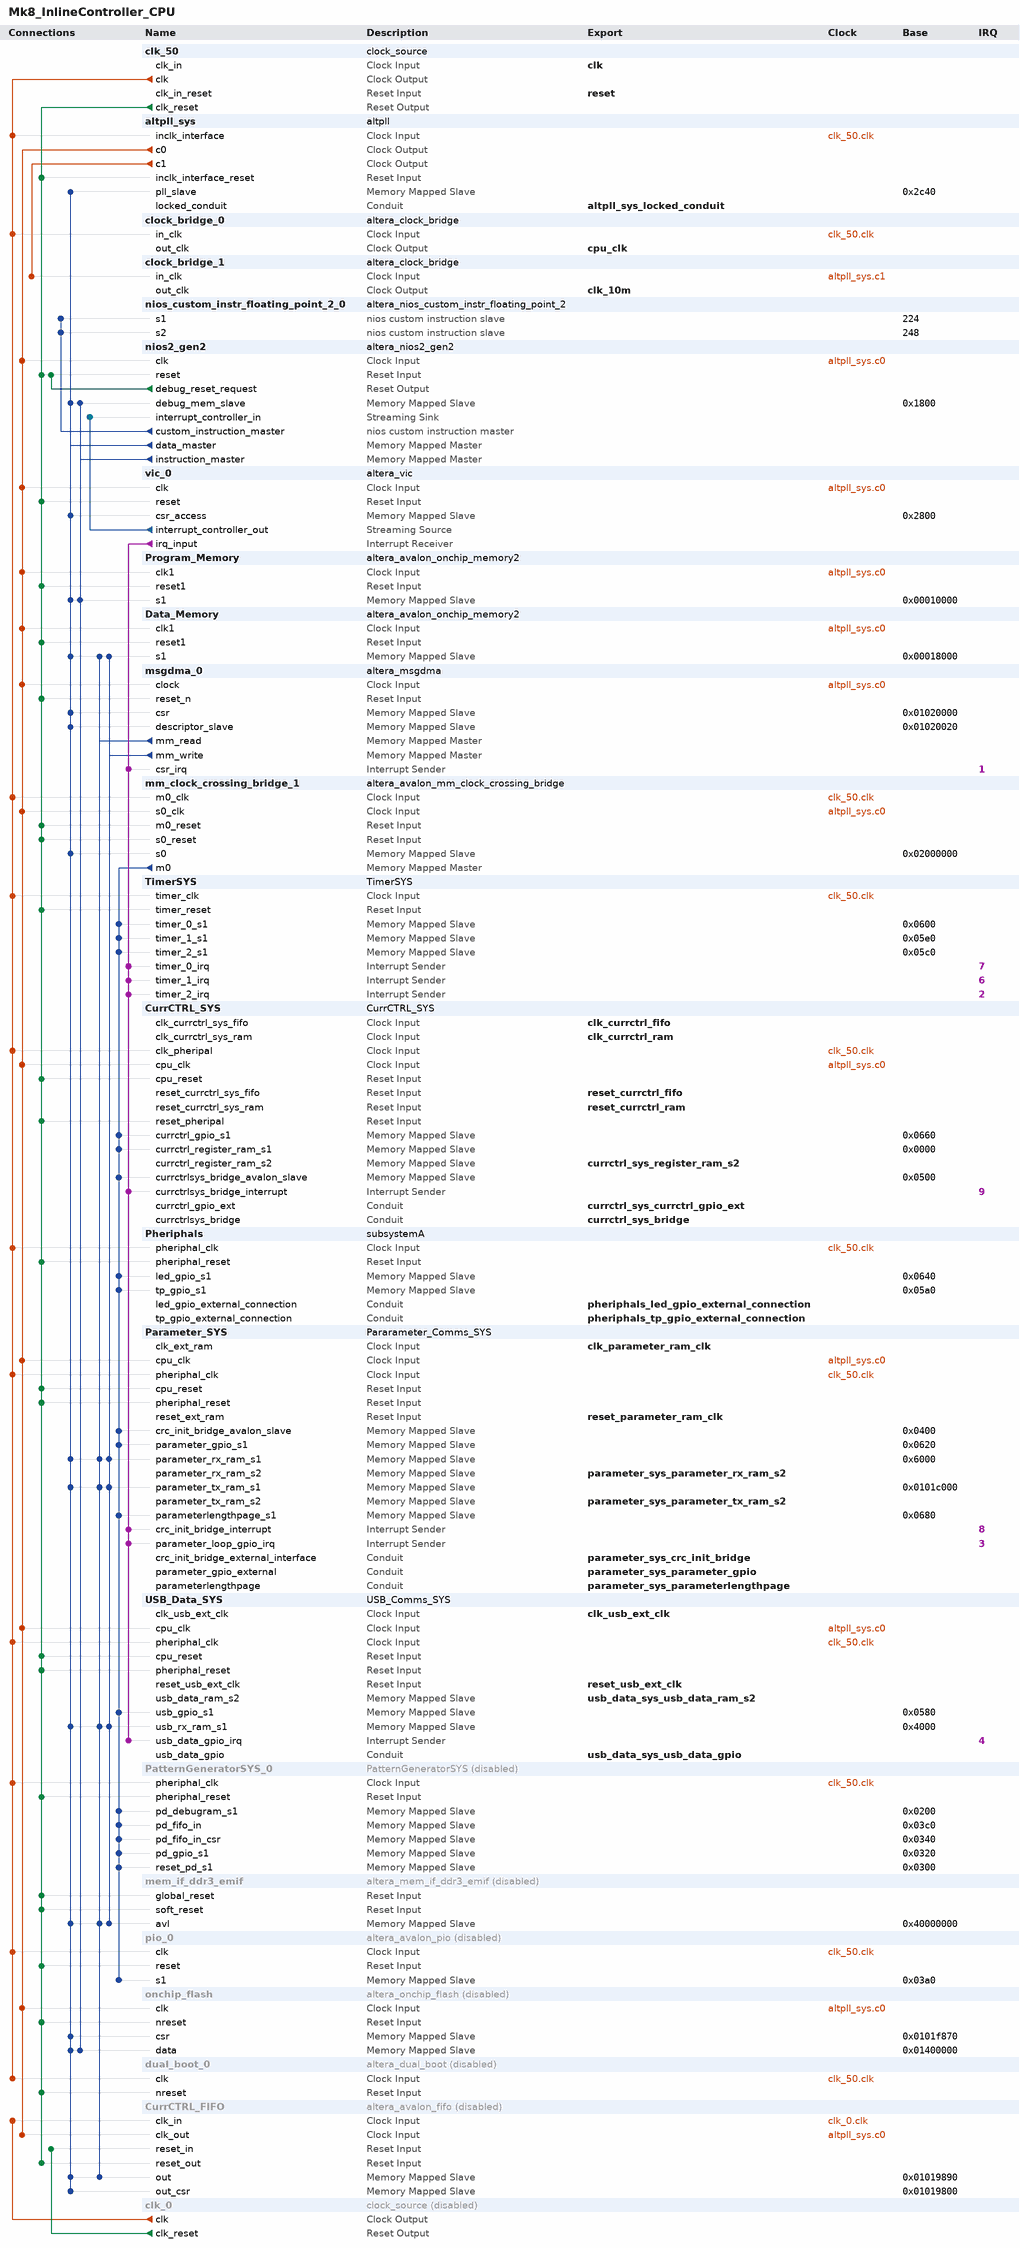
[diagram p0: system contents]
# Platform Designer (Qsys) system Mk8_InlineController_CPU, MAX 10 10M50DAF484I7G
# Parameters at their usual value, and those the tool derives, are not listed.
package require -exact qsys 18.1
create_system Mk8_InlineController_CPU
set_project_property DEVICE_FAMILY {MAX 10}
set_project_property DEVICE 10M50DAF484I7G

add_instance clk_50 clock_source 18.1
set_instance_parameter_value clk_50 clockFrequency 50000000

add_instance altpll_sys altpll 18.1
set_instance_parameter_value altpll_sys CLK0_DIVIDE_BY 2
set_instance_parameter_value altpll_sys CLK0_MULTIPLY_BY 3
set_instance_parameter_value altpll_sys CLK1_DIVIDE_BY 5
set_instance_parameter_value altpll_sys CLK1_DUTY_CYCLE 50
set_instance_parameter_value altpll_sys CLK1_MULTIPLY_BY 1
set_instance_parameter_value altpll_sys CLK1_PHASE_SHIFT 0
set_instance_parameter_value altpll_sys CLK2_DIVIDE_BY 1
set_instance_parameter_value altpll_sys CLK2_DUTY_CYCLE 50
set_instance_parameter_value altpll_sys CLK2_MULTIPLY_BY 4
set_instance_parameter_value altpll_sys CLK2_PHASE_SHIFT 0
set_instance_parameter_value altpll_sys CLK3_DIVIDE_BY 5
set_instance_parameter_value altpll_sys CLK3_DUTY_CYCLE 50
set_instance_parameter_value altpll_sys CLK3_MULTIPLY_BY 1
set_instance_parameter_value altpll_sys CLK3_PHASE_SHIFT 0
set_instance_parameter_value altpll_sys CLK4_DIVIDE_BY 1
set_instance_parameter_value altpll_sys CLK4_DUTY_CYCLE 50
set_instance_parameter_value altpll_sys CLK4_MULTIPLY_BY 4
set_instance_parameter_value altpll_sys CLK4_PHASE_SHIFT 0
set_instance_parameter_value altpll_sys INCLK0_INPUT_FREQUENCY 20000
set_instance_parameter_value altpll_sys PORT_ARESET PORT_UNUSED
set_instance_parameter_value altpll_sys PORT_LOCKED PORT_USED
set_instance_parameter_value altpll_sys PORT_clk1 PORT_USED
set_instance_parameter_value altpll_sys PORT_clk2 PORT_UNUSED
set_instance_parameter_value altpll_sys PORT_clk3 PORT_UNUSED

add_instance clock_bridge_0 altera_clock_bridge 18.1
set_instance_parameter_value clock_bridge_0 DERIVED_CLOCK_RATE 50000000
set_instance_parameter_value clock_bridge_0 EXPLICIT_CLOCK_RATE 0

add_instance clock_bridge_1 altera_clock_bridge 18.1
set_instance_parameter_value clock_bridge_1 DERIVED_CLOCK_RATE 10000000
set_instance_parameter_value clock_bridge_1 EXPLICIT_CLOCK_RATE 0

add_instance nios_custom_instr_floating_point_2_0 altera_nios_custom_instr_floating_point_2 18.1
set_instance_parameter_value nios_custom_instr_floating_point_2_0 arithmetic_present true
set_instance_parameter_value nios_custom_instr_floating_point_2_0 comparison_present true
set_instance_parameter_value nios_custom_instr_floating_point_2_0 conversion_present true
set_instance_parameter_value nios_custom_instr_floating_point_2_0 root_present false

add_instance nios2_gen2 altera_nios2_gen2 18.1
set_instance_parameter_value nios2_gen2 dcache_size 0
set_instance_parameter_value nios2_gen2 exceptionSlave Program_Memory.s1
set_instance_parameter_value nios2_gen2 icache_size 4096
set_instance_parameter_value nios2_gen2 impl Fast
set_instance_parameter_value nios2_gen2 io_regionbase 262144
set_instance_parameter_value nios2_gen2 mul_64_impl 1
set_instance_parameter_value nios2_gen2 mul_shift_choice 1
set_instance_parameter_value nios2_gen2 resetSlave Program_Memory.s1
set_instance_parameter_value nios2_gen2 setting_interruptControllerType External
set_instance_parameter_value nios2_gen2 setting_shadowRegisterSets 8

add_instance vic_0 altera_vic 18.1
set_instance_parameter_value vic_0 DAISY_CHAIN_ENABLE 0
set_instance_parameter_value vic_0 INTERRUPT_LATENCY_CYCLES 2
set_instance_parameter_value vic_0 NUMBER_OF_INT_PORTS 10
set_instance_parameter_value vic_0 OVERRIDE_INTERRUPT_LATENCY false
set_instance_parameter_value vic_0 RIL_WIDTH 4

add_instance Program_Memory altera_avalon_onchip_memory2 18.1
set_instance_parameter_value Program_Memory dataWidth 32
set_instance_parameter_value Program_Memory dualPort false
set_instance_parameter_value Program_Memory initMemContent true
set_instance_parameter_value Program_Memory initializationFileName C:/DesignData/CoilDriverDesigns/Mk_8/Inline_Controller/HardwareDesignCopy/EB_Mk8_Inline_Controller_Hardware/software/Temp_inlineCode/mem_init/Mk8_InlineController_CPU_Program_Memory.hex
set_instance_parameter_value Program_Memory memorySize 32768

add_instance Data_Memory altera_avalon_onchip_memory2 18.1
set_instance_parameter_value Data_Memory dataWidth 32
set_instance_parameter_value Data_Memory dualPort false
set_instance_parameter_value Data_Memory initMemContent true
set_instance_parameter_value Data_Memory initializationFileName onchip_mem.hex
set_instance_parameter_value Data_Memory memorySize 9216

add_instance msgdma_0 altera_msgdma 18.1
set_instance_parameter_value msgdma_0 BURST_ENABLE 0
set_instance_parameter_value msgdma_0 DATA_FIFO_DEPTH 32
set_instance_parameter_value msgdma_0 DATA_WIDTH 32
set_instance_parameter_value msgdma_0 DESCRIPTOR_FIFO_DEPTH 128
set_instance_parameter_value msgdma_0 ENHANCED_FEATURES 1
set_instance_parameter_value msgdma_0 ERROR_ENABLE 0
set_instance_parameter_value msgdma_0 MAX_BURST_COUNT 2
set_instance_parameter_value msgdma_0 MAX_BYTE 8192
set_instance_parameter_value msgdma_0 MODE 0
set_instance_parameter_value msgdma_0 PACKET_ENABLE 0
set_instance_parameter_value msgdma_0 STRIDE_ENABLE 1
set_instance_parameter_value msgdma_0 TRANSFER_TYPE {Full Word Accesses Only}

add_instance mm_clock_crossing_bridge_1 altera_avalon_mm_clock_crossing_bridge 18.1
set_instance_parameter_value mm_clock_crossing_bridge_1 ADDRESS_WIDTH 10
set_instance_parameter_value mm_clock_crossing_bridge_1 COMMAND_FIFO_DEPTH 4
set_instance_parameter_value mm_clock_crossing_bridge_1 DATA_WIDTH 32
set_instance_parameter_value mm_clock_crossing_bridge_1 MASTER_SYNC_DEPTH 2
set_instance_parameter_value mm_clock_crossing_bridge_1 MAX_BURST_SIZE 1
set_instance_parameter_value mm_clock_crossing_bridge_1 RESPONSE_FIFO_DEPTH 4
set_instance_parameter_value mm_clock_crossing_bridge_1 SLAVE_SYNC_DEPTH 2
set_instance_parameter_value mm_clock_crossing_bridge_1 USE_AUTO_ADDRESS_WIDTH 1

add_instance TimerSYS TimerSYS 1.0

add_instance CurrCTRL_SYS CurrCTRL_SYS 1.0

add_instance Pheriphals subsystemA 1.0

add_instance Parameter_SYS Pararameter_Comms_SYS 1.0

add_instance USB_Data_SYS USB_Comms_SYS 1.0

add_instance PatternGeneratorSYS_0 PatternGeneratorSYS 1.0
set_instance_property PatternGeneratorSYS_0 ENABLED false

add_instance mem_if_ddr3_emif altera_mem_if_ddr3_emif 18.1
set_instance_property mem_if_ddr3_emif ENABLED false
set_instance_parameter_value mem_if_ddr3_emif AVL_MAX_SIZE 4
set_instance_parameter_value mem_if_ddr3_emif CALIBRATION_MODE Skip
set_instance_parameter_value mem_if_ddr3_emif CPORT_TYPE_PORT Bidirectional,Bidirectional,Bidirectional,Bidirectional,Bidirectional,Bidirectional
set_instance_parameter_value mem_if_ddr3_emif EXPORT_AFI_HALF_CLK false
set_instance_parameter_value mem_if_ddr3_emif HARD_EMIF false
set_instance_parameter_value mem_if_ddr3_emif MEM_BANKADDR_WIDTH 3
set_instance_parameter_value mem_if_ddr3_emif MEM_CLK_FREQ 300.0
set_instance_parameter_value mem_if_ddr3_emif MEM_CLK_FREQ_MAX 800.0
set_instance_parameter_value mem_if_ddr3_emif MEM_COL_ADDR_WIDTH 10
set_instance_parameter_value mem_if_ddr3_emif MEM_DQ_WIDTH 16
set_instance_parameter_value mem_if_ddr3_emif MEM_FORMAT DISCRETE
set_instance_parameter_value mem_if_ddr3_emif MEM_ROW_ADDR_WIDTH 16
set_instance_parameter_value mem_if_ddr3_emif MEM_TCL 7
set_instance_parameter_value mem_if_ddr3_emif MEM_TFAW_NS 45.0
set_instance_parameter_value mem_if_ddr3_emif MEM_TRAS_NS 35.0
set_instance_parameter_value mem_if_ddr3_emif MEM_TRCD_NS 13.75
set_instance_parameter_value mem_if_ddr3_emif MEM_TRFC_NS 260.0
set_instance_parameter_value mem_if_ddr3_emif MEM_TRP_NS 13.75
set_instance_parameter_value mem_if_ddr3_emif MEM_TRRD_NS 7.5
set_instance_parameter_value mem_if_ddr3_emif MEM_TRTP_NS 7.5
set_instance_parameter_value mem_if_ddr3_emif MEM_TWTR 6
set_instance_parameter_value mem_if_ddr3_emif MEM_VENDOR Micron
set_instance_parameter_value mem_if_ddr3_emif MEM_WTCL 6
set_instance_parameter_value mem_if_ddr3_emif PLL_LOCATION Top_Bottom
set_instance_parameter_value mem_if_ddr3_emif POWER_OF_TWO_BUS true
set_instance_parameter_value mem_if_ddr3_emif PRIORITY_PORT 1,1,1,1,1,1
set_instance_parameter_value mem_if_ddr3_emif RATE Half
set_instance_parameter_value mem_if_ddr3_emif REF_CLK_FREQ 60.0
set_instance_parameter_value mem_if_ddr3_emif SPEED_GRADE 6
set_instance_parameter_value mem_if_ddr3_emif TIMING_BOARD_AC_SKEW 0.017
set_instance_parameter_value mem_if_ddr3_emif TIMING_BOARD_AC_TO_CK_SKEW -1.3E-4
set_instance_parameter_value mem_if_ddr3_emif TIMING_BOARD_DQ_TO_DQS_SKEW -6.0E-4
set_instance_parameter_value mem_if_ddr3_emif TIMING_BOARD_MAX_CK_DELAY 0.183
set_instance_parameter_value mem_if_ddr3_emif TIMING_BOARD_MAX_DQS_DELAY 0.181
set_instance_parameter_value mem_if_ddr3_emif TIMING_BOARD_SKEW_BETWEEN_DQS 0.005
set_instance_parameter_value mem_if_ddr3_emif TIMING_BOARD_SKEW_CKDQS_DIMM_MAX 0.007
set_instance_parameter_value mem_if_ddr3_emif TIMING_BOARD_SKEW_CKDQS_DIMM_MIN 0.002
set_instance_parameter_value mem_if_ddr3_emif TIMING_BOARD_SKEW_WITHIN_DQS 0.008
set_instance_parameter_value mem_if_ddr3_emif TIMING_TDH 55
set_instance_parameter_value mem_if_ddr3_emif TIMING_TDQSCK 225
set_instance_parameter_value mem_if_ddr3_emif TIMING_TDQSQ 125
set_instance_parameter_value mem_if_ddr3_emif TIMING_TDQSS 0.25
set_instance_parameter_value mem_if_ddr3_emif TIMING_TDS 55
set_instance_parameter_value mem_if_ddr3_emif TIMING_TDSH 0.2
set_instance_parameter_value mem_if_ddr3_emif TIMING_TDSS 0.2
set_instance_parameter_value mem_if_ddr3_emif TIMING_TIH 130
set_instance_parameter_value mem_if_ddr3_emif TIMING_TIS 185
set_instance_parameter_value mem_if_ddr3_emif TIMING_TQSH 0.4
set_instance_parameter_value mem_if_ddr3_emif USER_DEBUG_LEVEL 1

add_instance pio_0 altera_avalon_pio 18.1
set_instance_property pio_0 ENABLED false
set_instance_parameter_value pio_0 direction Input
set_instance_parameter_value pio_0 simDoTestBenchWiring true
set_instance_parameter_value pio_0 width 4

add_instance onchip_flash altera_onchip_flash 18.1
set_instance_property onchip_flash ENABLED false
set_instance_parameter_value onchip_flash CLOCK_FREQUENCY 100.0
set_instance_parameter_value onchip_flash CONFIGURATION_MODE {Single Compressed Image with Memory Initialization}
set_instance_parameter_value onchip_flash SECTOR_ACCESS_MODE {Read and write,Read and write,Read and write,Read and write,Read and write}
set_instance_parameter_value onchip_flash initFlashContent false
set_instance_parameter_value onchip_flash initializationFileName altera_onchip_flash.hex
set_instance_parameter_value onchip_flash useNonDefaultInitFile false

add_instance dual_boot_0 altera_dual_boot 18.1
set_instance_property dual_boot_0 ENABLED false
set_instance_parameter_value dual_boot_0 CLOCK_FREQUENCY 50.0

add_instance CurrCTRL_FIFO altera_avalon_fifo 18.1
set_instance_property CurrCTRL_FIFO ENABLED false
set_instance_parameter_value CurrCTRL_FIFO bitsPerSymbol 16
set_instance_parameter_value CurrCTRL_FIFO channelWidth 8
set_instance_parameter_value CurrCTRL_FIFO errorWidth 8
set_instance_parameter_value CurrCTRL_FIFO fifoDepth 8192
set_instance_parameter_value CurrCTRL_FIFO fifoInputInterfaceOptions AVALONMM_WRITE
set_instance_parameter_value CurrCTRL_FIFO fifoOutputInterfaceOptions AVALONMM_READ
set_instance_parameter_value CurrCTRL_FIFO singleClockMode false
set_instance_parameter_value CurrCTRL_FIFO symbolsPerBeat 2
set_instance_parameter_value CurrCTRL_FIFO useBackpressure false
set_instance_parameter_value CurrCTRL_FIFO useIRQ false
set_instance_parameter_value CurrCTRL_FIFO usePacket true
set_instance_parameter_value CurrCTRL_FIFO useReadControl true
set_instance_parameter_value CurrCTRL_FIFO useWriteControl false

add_instance clk_0 clock_source 18.1
set_instance_property clk_0 ENABLED false
set_instance_parameter_value clk_0 clockFrequency 50000000

# connections
add_connection altpll_sys.c0 CurrCTRL_FIFO.clk_out clock
add_connection altpll_sys.c0 CurrCTRL_SYS.cpu_clk clock
add_connection altpll_sys.c0 Data_Memory.clk1 clock
add_connection altpll_sys.c0 mm_clock_crossing_bridge_1.s0_clk clock
add_connection altpll_sys.c0 msgdma_0.clock clock
add_connection altpll_sys.c0 nios2_gen2.clk clock
add_connection altpll_sys.c0 onchip_flash.clk clock
add_connection altpll_sys.c0 Parameter_SYS.cpu_clk clock
add_connection altpll_sys.c0 Program_Memory.clk1 clock
add_connection altpll_sys.c0 USB_Data_SYS.cpu_clk clock
add_connection altpll_sys.c0 vic_0.clk clock
add_connection altpll_sys.c1 clock_bridge_1.in_clk clock
add_connection clk_0.clk CurrCTRL_FIFO.clk_in clock
add_connection clk_50.clk altpll_sys.inclk_interface clock
add_connection clk_50.clk clock_bridge_0.in_clk clock
add_connection clk_50.clk CurrCTRL_SYS.clk_pheripal clock
add_connection clk_50.clk dual_boot_0.clk clock
add_connection clk_50.clk mm_clock_crossing_bridge_1.m0_clk clock
add_connection clk_50.clk Parameter_SYS.pheriphal_clk clock
add_connection clk_50.clk PatternGeneratorSYS_0.pheriphal_clk clock
add_connection clk_50.clk Pheriphals.pheriphal_clk clock
add_connection clk_50.clk pio_0.clk clock
add_connection clk_50.clk TimerSYS.timer_clk clock
add_connection clk_50.clk USB_Data_SYS.pheriphal_clk clock
add_connection clk_0.clk_reset CurrCTRL_FIFO.reset_in reset
add_connection clk_50.clk_reset altpll_sys.inclk_interface_reset reset
add_connection clk_50.clk_reset CurrCTRL_FIFO.reset_out reset
add_connection clk_50.clk_reset CurrCTRL_SYS.cpu_reset reset
add_connection clk_50.clk_reset CurrCTRL_SYS.reset_pheripal reset
add_connection clk_50.clk_reset Data_Memory.reset1 reset
add_connection clk_50.clk_reset dual_boot_0.nreset reset
add_connection clk_50.clk_reset mem_if_ddr3_emif.global_reset reset
add_connection clk_50.clk_reset mem_if_ddr3_emif.soft_reset reset
add_connection clk_50.clk_reset mm_clock_crossing_bridge_1.m0_reset reset
add_connection clk_50.clk_reset mm_clock_crossing_bridge_1.s0_reset reset
add_connection clk_50.clk_reset msgdma_0.reset_n reset
add_connection clk_50.clk_reset nios2_gen2.reset reset
add_connection clk_50.clk_reset onchip_flash.nreset reset
add_connection clk_50.clk_reset Parameter_SYS.cpu_reset reset
add_connection clk_50.clk_reset Parameter_SYS.pheriphal_reset reset
add_connection clk_50.clk_reset PatternGeneratorSYS_0.pheriphal_reset reset
add_connection clk_50.clk_reset Pheriphals.pheriphal_reset reset
add_connection clk_50.clk_reset pio_0.reset reset
add_connection clk_50.clk_reset Program_Memory.reset1 reset
add_connection clk_50.clk_reset TimerSYS.timer_reset reset
add_connection clk_50.clk_reset USB_Data_SYS.cpu_reset reset
add_connection clk_50.clk_reset USB_Data_SYS.pheriphal_reset reset
add_connection clk_50.clk_reset vic_0.reset reset
add_connection nios2_gen2.debug_reset_request nios2_gen2.reset reset
add_connection mm_clock_crossing_bridge_1.m0 CurrCTRL_SYS.currctrl_gpio_s1 avalon
set_connection_parameter_value mm_clock_crossing_bridge_1.m0/CurrCTRL_SYS.currctrl_gpio_s1 baseAddress 0x0660
add_connection mm_clock_crossing_bridge_1.m0 CurrCTRL_SYS.currctrl_register_ram_s1 avalon
set_connection_parameter_value mm_clock_crossing_bridge_1.m0/CurrCTRL_SYS.currctrl_register_ram_s1 baseAddress 0x0000
add_connection mm_clock_crossing_bridge_1.m0 CurrCTRL_SYS.currctrlsys_bridge_avalon_slave avalon
set_connection_parameter_value mm_clock_crossing_bridge_1.m0/CurrCTRL_SYS.currctrlsys_bridge_avalon_slave baseAddress 0x0500
add_connection mm_clock_crossing_bridge_1.m0 Parameter_SYS.crc_init_bridge_avalon_slave avalon
set_connection_parameter_value mm_clock_crossing_bridge_1.m0/Parameter_SYS.crc_init_bridge_avalon_slave baseAddress 0x0400
add_connection mm_clock_crossing_bridge_1.m0 Parameter_SYS.parameter_gpio_s1 avalon
set_connection_parameter_value mm_clock_crossing_bridge_1.m0/Parameter_SYS.parameter_gpio_s1 baseAddress 0x0620
add_connection mm_clock_crossing_bridge_1.m0 Parameter_SYS.parameterlengthpage_s1 avalon
set_connection_parameter_value mm_clock_crossing_bridge_1.m0/Parameter_SYS.parameterlengthpage_s1 baseAddress 0x0680
add_connection mm_clock_crossing_bridge_1.m0 PatternGeneratorSYS_0.pd_debugram_s1 avalon
set_connection_parameter_value mm_clock_crossing_bridge_1.m0/PatternGeneratorSYS_0.pd_debugram_s1 baseAddress 0x0200
add_connection mm_clock_crossing_bridge_1.m0 PatternGeneratorSYS_0.pd_fifo_in avalon
set_connection_parameter_value mm_clock_crossing_bridge_1.m0/PatternGeneratorSYS_0.pd_fifo_in baseAddress 0x03c0
add_connection mm_clock_crossing_bridge_1.m0 PatternGeneratorSYS_0.pd_fifo_in_csr avalon
set_connection_parameter_value mm_clock_crossing_bridge_1.m0/PatternGeneratorSYS_0.pd_fifo_in_csr baseAddress 0x0340
add_connection mm_clock_crossing_bridge_1.m0 PatternGeneratorSYS_0.pd_gpio_s1 avalon
set_connection_parameter_value mm_clock_crossing_bridge_1.m0/PatternGeneratorSYS_0.pd_gpio_s1 baseAddress 0x0320
add_connection mm_clock_crossing_bridge_1.m0 PatternGeneratorSYS_0.reset_pd_s1 avalon
set_connection_parameter_value mm_clock_crossing_bridge_1.m0/PatternGeneratorSYS_0.reset_pd_s1 baseAddress 0x0300
add_connection mm_clock_crossing_bridge_1.m0 Pheriphals.led_gpio_s1 avalon
set_connection_parameter_value mm_clock_crossing_bridge_1.m0/Pheriphals.led_gpio_s1 baseAddress 0x0640
add_connection mm_clock_crossing_bridge_1.m0 Pheriphals.tp_gpio_s1 avalon
set_connection_parameter_value mm_clock_crossing_bridge_1.m0/Pheriphals.tp_gpio_s1 baseAddress 0x05a0
add_connection mm_clock_crossing_bridge_1.m0 pio_0.s1 avalon
set_connection_parameter_value mm_clock_crossing_bridge_1.m0/pio_0.s1 baseAddress 0x03a0
add_connection mm_clock_crossing_bridge_1.m0 TimerSYS.timer_0_s1 avalon
set_connection_parameter_value mm_clock_crossing_bridge_1.m0/TimerSYS.timer_0_s1 baseAddress 0x0600
add_connection mm_clock_crossing_bridge_1.m0 TimerSYS.timer_1_s1 avalon
set_connection_parameter_value mm_clock_crossing_bridge_1.m0/TimerSYS.timer_1_s1 baseAddress 0x05e0
add_connection mm_clock_crossing_bridge_1.m0 TimerSYS.timer_2_s1 avalon
set_connection_parameter_value mm_clock_crossing_bridge_1.m0/TimerSYS.timer_2_s1 baseAddress 0x05c0
add_connection mm_clock_crossing_bridge_1.m0 USB_Data_SYS.usb_gpio_s1 avalon
set_connection_parameter_value mm_clock_crossing_bridge_1.m0/USB_Data_SYS.usb_gpio_s1 baseAddress 0x0580
add_connection msgdma_0.mm_read CurrCTRL_FIFO.out avalon
set_connection_parameter_value msgdma_0.mm_read/CurrCTRL_FIFO.out baseAddress 0x01019890
add_connection msgdma_0.mm_read Data_Memory.s1 avalon
set_connection_parameter_value msgdma_0.mm_read/Data_Memory.s1 baseAddress 0x00018000
add_connection msgdma_0.mm_read mem_if_ddr3_emif.avl avalon
set_connection_parameter_value msgdma_0.mm_read/mem_if_ddr3_emif.avl baseAddress 0x40000000
add_connection msgdma_0.mm_read Parameter_SYS.parameter_rx_ram_s1 avalon
set_connection_parameter_value msgdma_0.mm_read/Parameter_SYS.parameter_rx_ram_s1 baseAddress 0x6000
add_connection msgdma_0.mm_read Parameter_SYS.parameter_tx_ram_s1 avalon
set_connection_parameter_value msgdma_0.mm_read/Parameter_SYS.parameter_tx_ram_s1 baseAddress 0x0101c000
add_connection msgdma_0.mm_read USB_Data_SYS.usb_rx_ram_s1 avalon
set_connection_parameter_value msgdma_0.mm_read/USB_Data_SYS.usb_rx_ram_s1 baseAddress 0x4000
add_connection msgdma_0.mm_write Data_Memory.s1 avalon
set_connection_parameter_value msgdma_0.mm_write/Data_Memory.s1 baseAddress 0x00018000
add_connection msgdma_0.mm_write mem_if_ddr3_emif.avl avalon
set_connection_parameter_value msgdma_0.mm_write/mem_if_ddr3_emif.avl baseAddress 0x40000000
add_connection msgdma_0.mm_write Parameter_SYS.parameter_rx_ram_s1 avalon
set_connection_parameter_value msgdma_0.mm_write/Parameter_SYS.parameter_rx_ram_s1 baseAddress 0x6000
add_connection msgdma_0.mm_write Parameter_SYS.parameter_tx_ram_s1 avalon
set_connection_parameter_value msgdma_0.mm_write/Parameter_SYS.parameter_tx_ram_s1 baseAddress 0x0101c000
add_connection msgdma_0.mm_write USB_Data_SYS.usb_rx_ram_s1 avalon
set_connection_parameter_value msgdma_0.mm_write/USB_Data_SYS.usb_rx_ram_s1 baseAddress 0x4000
add_connection nios2_gen2.data_master altpll_sys.pll_slave avalon
set_connection_parameter_value nios2_gen2.data_master/altpll_sys.pll_slave baseAddress 0x2c40
add_connection nios2_gen2.data_master CurrCTRL_FIFO.out avalon
set_connection_parameter_value nios2_gen2.data_master/CurrCTRL_FIFO.out baseAddress 0x01019890
add_connection nios2_gen2.data_master CurrCTRL_FIFO.out_csr avalon
set_connection_parameter_value nios2_gen2.data_master/CurrCTRL_FIFO.out_csr baseAddress 0x01019800
add_connection nios2_gen2.data_master Data_Memory.s1 avalon
set_connection_parameter_value nios2_gen2.data_master/Data_Memory.s1 baseAddress 0x00018000
add_connection nios2_gen2.data_master mem_if_ddr3_emif.avl avalon
set_connection_parameter_value nios2_gen2.data_master/mem_if_ddr3_emif.avl baseAddress 0x40000000
add_connection nios2_gen2.data_master mm_clock_crossing_bridge_1.s0 avalon
set_connection_parameter_value nios2_gen2.data_master/mm_clock_crossing_bridge_1.s0 baseAddress 0x02000000
add_connection nios2_gen2.data_master msgdma_0.csr avalon
set_connection_parameter_value nios2_gen2.data_master/msgdma_0.csr baseAddress 0x01020000
add_connection nios2_gen2.data_master msgdma_0.descriptor_slave avalon
set_connection_parameter_value nios2_gen2.data_master/msgdma_0.descriptor_slave baseAddress 0x01020020
add_connection nios2_gen2.data_master nios2_gen2.debug_mem_slave avalon
set_connection_parameter_value nios2_gen2.data_master/nios2_gen2.debug_mem_slave baseAddress 0x1800
add_connection nios2_gen2.data_master onchip_flash.csr avalon
set_connection_parameter_value nios2_gen2.data_master/onchip_flash.csr baseAddress 0x0101f870
add_connection nios2_gen2.data_master onchip_flash.data avalon
set_connection_parameter_value nios2_gen2.data_master/onchip_flash.data baseAddress 0x01400000
add_connection nios2_gen2.data_master Parameter_SYS.parameter_rx_ram_s1 avalon
set_connection_parameter_value nios2_gen2.data_master/Parameter_SYS.parameter_rx_ram_s1 baseAddress 0x6000
add_connection nios2_gen2.data_master Parameter_SYS.parameter_tx_ram_s1 avalon
set_connection_parameter_value nios2_gen2.data_master/Parameter_SYS.parameter_tx_ram_s1 baseAddress 0x0101c000
add_connection nios2_gen2.data_master Program_Memory.s1 avalon
set_connection_parameter_value nios2_gen2.data_master/Program_Memory.s1 baseAddress 0x00010000
add_connection nios2_gen2.data_master USB_Data_SYS.usb_rx_ram_s1 avalon
set_connection_parameter_value nios2_gen2.data_master/USB_Data_SYS.usb_rx_ram_s1 baseAddress 0x4000
add_connection nios2_gen2.data_master vic_0.csr_access avalon
set_connection_parameter_value nios2_gen2.data_master/vic_0.csr_access baseAddress 0x2800
add_connection nios2_gen2.instruction_master nios2_gen2.debug_mem_slave avalon
set_connection_parameter_value nios2_gen2.instruction_master/nios2_gen2.debug_mem_slave baseAddress 0x1800
add_connection nios2_gen2.instruction_master onchip_flash.data avalon
set_connection_parameter_value nios2_gen2.instruction_master/onchip_flash.data baseAddress 0x01400000
add_connection nios2_gen2.instruction_master Program_Memory.s1 avalon
set_connection_parameter_value nios2_gen2.instruction_master/Program_Memory.s1 baseAddress 0x00010000
add_connection vic_0.interrupt_controller_out nios2_gen2.interrupt_controller_in avalon_streaming
add_connection vic_0.irq_input CurrCTRL_SYS.currctrlsys_bridge_interrupt interrupt
set_connection_parameter_value vic_0.irq_input/CurrCTRL_SYS.currctrlsys_bridge_interrupt irqNumber 9
add_connection vic_0.irq_input msgdma_0.csr_irq interrupt
set_connection_parameter_value vic_0.irq_input/msgdma_0.csr_irq irqNumber 1
add_connection vic_0.irq_input Parameter_SYS.crc_init_bridge_interrupt interrupt
set_connection_parameter_value vic_0.irq_input/Parameter_SYS.crc_init_bridge_interrupt irqNumber 8
add_connection vic_0.irq_input Parameter_SYS.parameter_loop_gpio_irq interrupt
set_connection_parameter_value vic_0.irq_input/Parameter_SYS.parameter_loop_gpio_irq irqNumber 3
add_connection vic_0.irq_input TimerSYS.timer_0_irq interrupt
set_connection_parameter_value vic_0.irq_input/TimerSYS.timer_0_irq irqNumber 7
add_connection vic_0.irq_input TimerSYS.timer_1_irq interrupt
set_connection_parameter_value vic_0.irq_input/TimerSYS.timer_1_irq irqNumber 6
add_connection vic_0.irq_input TimerSYS.timer_2_irq interrupt
set_connection_parameter_value vic_0.irq_input/TimerSYS.timer_2_irq irqNumber 2
add_connection vic_0.irq_input USB_Data_SYS.usb_data_gpio_irq interrupt
set_connection_parameter_value vic_0.irq_input/USB_Data_SYS.usb_data_gpio_irq irqNumber 4
add_connection nios2_gen2.custom_instruction_master nios_custom_instr_floating_point_2_0.s1 nios_custom_instruction
set_connection_parameter_value nios2_gen2.custom_instruction_master/nios_custom_instr_floating_point_2_0.s1 CIName nios_custom_instr_floating_point_2_0
set_connection_parameter_value nios2_gen2.custom_instruction_master/nios_custom_instr_floating_point_2_0.s1 baseAddress 224
add_connection nios2_gen2.custom_instruction_master nios_custom_instr_floating_point_2_0.s2 nios_custom_instruction
set_connection_parameter_value nios2_gen2.custom_instruction_master/nios_custom_instr_floating_point_2_0.s2 CIName nios_custom_instr_floating_point_2_0_1
set_connection_parameter_value nios2_gen2.custom_instruction_master/nios_custom_instr_floating_point_2_0.s2 baseAddress 248

# exported interfaces
add_interface altpll_sys_locked_conduit conduit end
set_interface_property altpll_sys_locked_conduit EXPORT_OF altpll_sys.locked_conduit
add_interface clk clock sink
set_interface_property clk EXPORT_OF clk_50.clk_in
add_interface clk_10m clock source
set_interface_property clk_10m EXPORT_OF clock_bridge_1.out_clk
add_interface clk_currctrl_fifo clock sink
set_interface_property clk_currctrl_fifo EXPORT_OF CurrCTRL_SYS.clk_currctrl_sys_fifo
add_interface clk_currctrl_ram clock sink
set_interface_property clk_currctrl_ram EXPORT_OF CurrCTRL_SYS.clk_currctrl_sys_ram
add_interface clk_parameter_ram_clk clock sink
set_interface_property clk_parameter_ram_clk EXPORT_OF Parameter_SYS.clk_ext_ram
add_interface clk_usb_ext_clk clock sink
set_interface_property clk_usb_ext_clk EXPORT_OF USB_Data_SYS.clk_usb_ext_clk
add_interface cpu_clk clock source
set_interface_property cpu_clk EXPORT_OF clock_bridge_0.out_clk
add_interface currctrl_sys_bridge conduit end
set_interface_property currctrl_sys_bridge EXPORT_OF CurrCTRL_SYS.currctrlsys_bridge
add_interface currctrl_sys_currctrl_gpio_ext conduit end
set_interface_property currctrl_sys_currctrl_gpio_ext EXPORT_OF CurrCTRL_SYS.currctrl_gpio_ext
add_interface currctrl_sys_register_ram_s2 avalon slave
set_interface_property currctrl_sys_register_ram_s2 EXPORT_OF CurrCTRL_SYS.currctrl_register_ram_s2
add_interface parameter_sys_crc_init_bridge conduit end
set_interface_property parameter_sys_crc_init_bridge EXPORT_OF Parameter_SYS.crc_init_bridge_external_interface
add_interface parameter_sys_parameter_gpio conduit end
set_interface_property parameter_sys_parameter_gpio EXPORT_OF Parameter_SYS.parameter_gpio_external
add_interface parameter_sys_parameter_rx_ram_s2 avalon slave
set_interface_property parameter_sys_parameter_rx_ram_s2 EXPORT_OF Parameter_SYS.parameter_rx_ram_s2
add_interface parameter_sys_parameter_tx_ram_s2 avalon slave
set_interface_property parameter_sys_parameter_tx_ram_s2 EXPORT_OF Parameter_SYS.parameter_tx_ram_s2
add_interface parameter_sys_parameterlengthpage conduit end
set_interface_property parameter_sys_parameterlengthpage EXPORT_OF Parameter_SYS.parameterlengthpage
add_interface pheriphals_led_gpio_external_connection conduit end
set_interface_property pheriphals_led_gpio_external_connection EXPORT_OF Pheriphals.led_gpio_external_connection
add_interface pheriphals_tp_gpio_external_connection conduit end
set_interface_property pheriphals_tp_gpio_external_connection EXPORT_OF Pheriphals.tp_gpio_external_connection
add_interface reset reset sink
set_interface_property reset EXPORT_OF clk_50.clk_in_reset
add_interface reset_currctrl_fifo reset sink
set_interface_property reset_currctrl_fifo EXPORT_OF CurrCTRL_SYS.reset_currctrl_sys_fifo
add_interface reset_currctrl_ram reset sink
set_interface_property reset_currctrl_ram EXPORT_OF CurrCTRL_SYS.reset_currctrl_sys_ram
add_interface reset_parameter_ram_clk reset sink
set_interface_property reset_parameter_ram_clk EXPORT_OF Parameter_SYS.reset_ext_ram
add_interface reset_usb_ext_clk reset sink
set_interface_property reset_usb_ext_clk EXPORT_OF USB_Data_SYS.reset_usb_ext_clk
add_interface usb_data_sys_usb_data_gpio conduit end
set_interface_property usb_data_sys_usb_data_gpio EXPORT_OF USB_Data_SYS.usb_data_gpio
add_interface usb_data_sys_usb_data_ram_s2 avalon slave
set_interface_property usb_data_sys_usb_data_ram_s2 EXPORT_OF USB_Data_SYS.usb_data_ram_s2

set_interconnect_requirement {$system} qsys_mm.clockCrossingAdapter HANDSHAKE
set_interconnect_requirement {$system} qsys_mm.enableEccProtection FALSE
set_interconnect_requirement {$system} qsys_mm.insertDefaultSlave FALSE
set_interconnect_requirement {$system} qsys_mm.maxAdditionalLatency 1

save_system Mk8_InlineController_CPU.qsys
